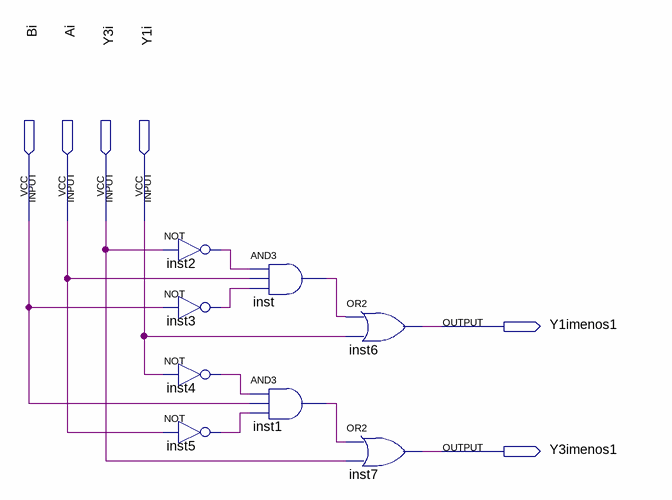
[diagram p0: schematic sheet]
// Quartus schematic q52.bdf as structural Verilog: 8 symbols, 6 pins
module q52 (
  input  Bi,
  input  Ai,
  input  Y3i,
  input  Y1i,
  output Y1imenos1,
  output Y3imenos1
);

  wire inst1_out, inst2_out, inst3_out, inst4_out, inst5_out, inst_out;

  not inst2 (inst2_out, Y3i);
  not inst3 (inst3_out, Bi);
  not inst4 (inst4_out, Y1i);
  not inst5 (inst5_out, Ai);
  and inst (inst_out, inst2_out, Ai, inst3_out);
  and inst1 (inst1_out, inst4_out, Bi, inst5_out);
  or inst6 (Y1imenos1, inst_out, Y1i);
  or inst7 (Y3imenos1, inst1_out, Y3i);
endmodule
